# EAGLE design WT12-Teensy3.1 (EAGLE 6.3)
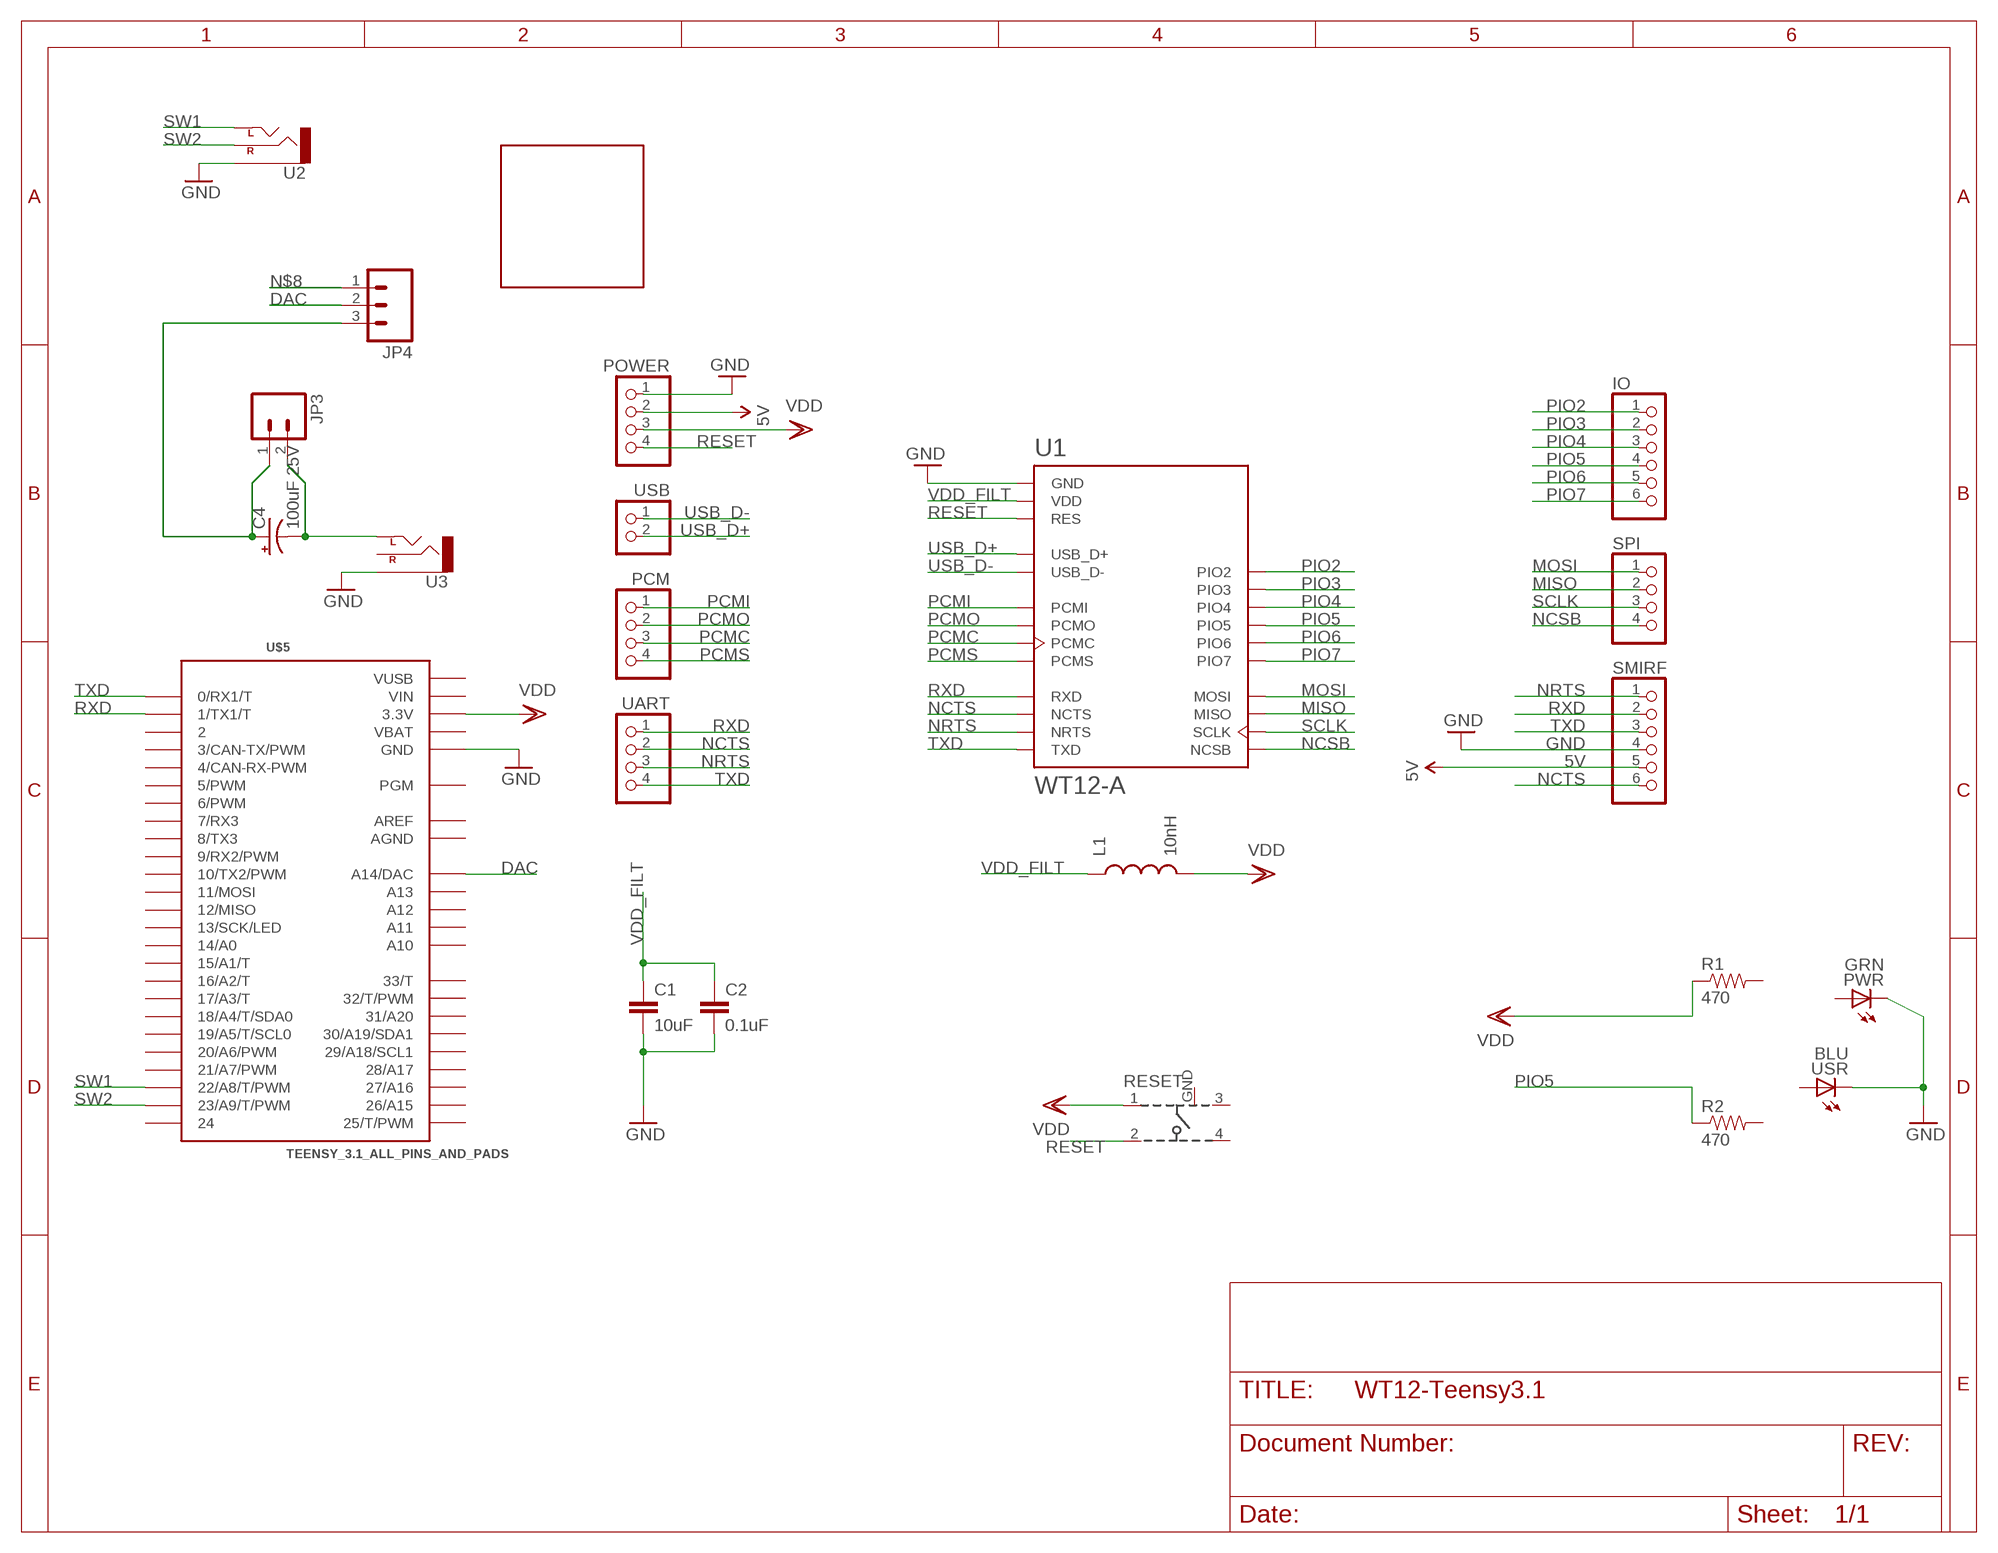
[diagram p0: schematic, sheet 1]

## Parts
C1  10uF  CAP0603-CAP  [0603-CAP]
C2  0.1uF  CAP0603-CAP  [0603-CAP]
C4  100uF 25V  CAP_POLPTH2  [CPOL-RADIAL-10UF-25V]
IO  PINHD-1X6  [1X06]
JP3  M02PTH  [1X02]
JP4  M03LOCK  [1X03_LOCK]
L1  10nH  INDUCTOR0603  [0603]
PCM  PINHD-1X4  [1X04]
POWER  PINHD-1X4  [1X04]
PWR  GRN  LEDCHIPLED_0805  [CHIPLED_0805]
R1  470  RESISTOR0603-RES  [0603-RES]
R2  470  RESISTOR0603-RES  [0603-RES]
RESET  101-IG  [101-IG]
SMIRF  PINHD-1X6  [1X06]
SPI  PINHD-1X4  [1X04]
U1  WT12-A  [WT12-A]
U2  AUDIO-JACKPTH  [AUDIO-JACK]
U3  AUDIO-JACKPTH  [AUDIO-JACK]
U$1  PROTOAREA  [PROTOAREA]
U$5  TEENSY_3.1_ALL_PINS_AND_PADS  [TEENSY_3.1_ALLPINS]
UART  PINHD-1X4  [1X04]
USB  PINHD-1X2  [1X02]
USR  BLU  LEDCHIPLED_0805  [CHIPLED_0805]

## Nets
5V [power]: POWER.2 SMIRF.5
DAC: JP4.2 U$5.A14(A14/DAC)
GND [power]: C1.2 C2.2 POWER.1 PWR.C SMIRF.4 U1.GND U1.GND@2(GND) U1.GND@3(GND) U1.GND@4(GND) U2.SLEEVE U3.SLEEVE USR.C
MISO: SPI.2 U1.MISO
MOSI: SPI.1 U1.MOSI
N$4: R2.1
N$7: C4.2(-) JP3.2 U3.TIP(LEFT)
N$8: JP4.1
N$10: C4.1(+) JP3.1 JP4.3
NCSB: SPI.4 U1.NCSB
NCTS: SMIRF.6 U1.NCTS UART.2
NRTS: SMIRF.1 U1.NRTS UART.3
PCMC: PCM.3 U1.PCMC
PCMI: PCM.1 U1.PCMI
PCMO: PCM.2 U1.PCMO
PCMS: PCM.4 U1.PCMS
PIO2: IO.1 U1.PIO2
PIO3: IO.2 U1.PIO3
PIO4: IO.3 U1.PIO4
PIO5: IO.4 U1.PIO5
PIO6: IO.5 U1.PIO6
PIO7: IO.6 U1.PIO7
RESET: POWER.4 RESET.2 U1.RES
RXD: SMIRF.2 U1.RXD U$5.1(1/TX1/T) UART.1
SCLK: SPI.3 U1.SCLK
SW1: U2.TIP(LEFT) U$5.22/A8(22/A8/T/PWM)
SW2: U2.RING(RIGHT) U$5.23/A9(23/A9/T/PWM)
TXD: SMIRF.3 U1.TXD U$5.0(0/RX1/T) UART.4
USB_D+: U1.USB_D+ USB.2
USB_D-: U1.USB_D- USB.1
VDD [power]: L1.2 POWER.3 RESET.1
VDD_FILT [power]: C1.1 C2.1 L1.1 U1.VDD U1.VDD@2(VDD)
VDDJP1 [power]: R1.1
Unconnected: PWR.A R1.2 R2.2 RESET.3 RESET.4 U3.RING(RIGHT) U$5.2 U$5.3(3/CAN-TX/PWM) U$5.4(4/CAN-RX-PWM) U$5.5(5/PWM) U$5.6(6/PWM) U$5.7(7/RX3) U$5.8(8/TX3) U$5.9(9/RX2/PWM) U$5.10(10/TX2/PWM) U$5.11(11/MOSI) U$5.12(12/MISO) U$5.13(13/SCK/LED) U$5.14/A0 U$5.15/A1(15/A1/T) U$5.16/A2(16/A2/T) U$5.17/A3(17/A3/T) U$5.18/A4(18/A4/T/SDA0) U$5.19/A5(19/A5/T/SCL0) U$5.20/A6(20/A6/PWM) U$5.21/A7(21/A7/PWM) U$5.24 U$5.25(25/T/PWM) U$5.26(26/A15) U$5.27(27/A16) U$5.28(28/A17) U$5.29(29/A18/SCL1) U$5.30(30/A19/SDA1) U$5.31(31/A20) U$5.32(32/T/PWM) U$5.33(33/T) U$5.A10 U$5.A11 U$5.A12 U$5.A13 U$5.PGM USR.A

## Power pins joined to a net without a drawn wire
3.3V: U$5.3.3V U$5.3.3V1(3.3V) U$5.3.3V2(3.3V)
AGND: U$5.AGND
AREF: U$5.AREF
GND: RESET.GND U$5.GND U$5.GND1(GND) U$5.GND2(GND)
VBAT: U$5.VBAT
VIN: U$5.VIN
VUSB: U$5.VUSB

## Library data of the parts
C1 C2 = SparkFun:CAP: Capacitor Standard 0603 ceramic capacitor, and 0.1" leaded capacitor.
C4 = SparkFun-Passives:CAP_POL: Capacitor Polarized These are standard SMD and PTH capacitors. Normally 10uF, 47uF, and 100uF in electrolytic and tantalum varieties. Always verify the external diameter of the through hole cap, it varies with capacity, voltage, and manufacturer. The EIA devices should be standard.
IO SMIRF = sf-pinhead:PINHD-1X6: PIN HEADER
JP3 = SparkFun-Connectors:M02: Header 2 Standard 2-pin 0.1" header. Use with straight break away headers (SKU : PRT-00116), right angle break away headers (PRT-00553), swiss pins (PRT-00743), machine pins (PRT-00117), and female headers (PRT-00115). Molex polarized connector foot print use with SKU : PRT-08233 with associated crimp pins and housings.
JP4 = SparkFun-Connectors:M03: Header 3 Standard 3-pin 0.1" header. Use with straight break away headers (SKU : PRT-00116), right angle break away headers (PRT-00553), swiss pins (PRT-00743), machine pins (PRT-00117), and female headers (PRT-00115). Molex polarized connector foot print use with SKU : PRT-08232 with associated crimp pins and housings.
L1 = SparkFun:INDUCTOR: Inductors Basic Inductor/Choke - 0603 and 1206. Footprints are not proven and vary greatly between part numbers.
PCM POWER SPI UART = sf-pinhead:PINHD-1X4: PIN HEADER
PWR USR = adafruit:LED: LED OSRAM: - CHIPLED LG R971, LG N971, LY N971, LG Q971, LY Q971, LO R971, LY R971 LH N974, LH R974 LS Q976, LO Q976, LY Q976 LO Q996 - Hyper CHIPLED LW Q18S LB Q993, LB Q99A, LB R99A - SideLED LS A670, LO A670, LY A670, LG A670, LP A670 LB A673, LV A673, LT A673, LW A673 LH A674 LY A675 LS A676, LA A676, LO A676, LY A676, LW A676 LS A679, LY A679, LG A679 - Hyper Micro SIDELED® LS Y876, LA Y876, LO Y876, LY Y876 LT Y87S - SmartLED LW L88C, LW L88S LB L89C, LB L89S, LG L890 LS L89K, LO L89K, LY L89K LS L896, LA L896, LO L896, LY L896 - TOPLED LS T670, LO T670, LY T670, LG T670, LP T670 LSG T670, LSP T670, LSY T670, LOP T670, LYG T670 LG T671, LOG T671, LSG T671 LB T673, LV T673, LT T673, LW T673 LH T674 LS T676, LA T676, LO T676, LY T676, LB T676, LH T676, LSB T676, LW T676 LB T67C, LV T67C, LT T67C, LS T67K, LO T67K, LY T67K, LW E67C LS E67B, LA E67B, LO E67B, LY E67B, LB E67C, LV E67C, LT E67C LW T67C LS T679, LY T679, LG T679 LS T770, LO T770, LY T770, LG T770, LP T770 LB T773, LV T773, LT T773, LW T773 LH T774 LS E675, LA E675, LY E675, LS T675 LS T776, LA T776, LO T776, LY T776, LB T776 LHGB T686 LT T68C, LB T68C - Hyper Mini TOPLED® LB M676 - Mini TOPLED Santana® LG M470 LS M47K, LO M47K, LY M47K Source: http://www.osram.convergy.de/
R1 R2 = SparkFun:RESISTOR: Resistor Basic schematic elements and footprints for 0603, 1206, and PTH resistors.
RESET = sf-keyglove:101-IG
U1 = sf-bluegiga:WT12: Bluegiga WT12 class 2 Bluetooth 2.1 + EDR module. WT12-A variant has an on-module ceramic chip antenna. WT12-A variant includes keepout/restrict area. Antenna edge of the module should be flush up against the edge of the PCB. See datasheet for variant layout details. The WT12 is a fully integrated Bluetooth 2.1 + EDR, class 2 module combining antenna, Bluetooth radio, and an on-board iWRAP Bluetooth stack. Bluegiga's WT12 constitutes the ideal solution for developers that want to quickly integrate Bluetooth wireless technology into their design without investing several months in Bluetooth radio and stack development. It uses Bluegiga's iWRAP Bluetooth stack, which is an embedded Bluetooth stack implementing 13 different Bluetooth profiles and Apple iAP connectivity. The WT12 combined with iWRAP Bluetooth stack and Bluegiga's excellent technical support designers ensure quick time-to-market and low development costs and risks. http://www.bluegiga.com/en-US/products/bluetooth-classic-modules/wt12-bluetooth--class-2-module https://github.com/jrowberg/sf-oshw Last updated 2014-01-04 by Jeff Rowberg <jeff@rowberg.net>; ANTENNA: On-module ceramic chip antenna
U2 U3 = SparkFun-Connectors:AUDIO-JACK: 3.5mm Audio Jack Simple 3.5mm common PCB mount audio jack. SKU: PRT-08032
U$1 = zunkworks:PROTOAREA
U$5 = Teensy_3_Series_Board_v1.0:TEENSY_3.1_ALL_PINS_AND_PADS: Footprint for Teensy 3.1 board using all pads and all through-holes. Pads need a 2x7 0.1" SMD header.
USB = sf-pinhead:PINHD-1X2: PIN HEADER

## Net classes
0 default: width 0.152 mm, drill 0.33 mm, clearance 0.152 mm
1 power: width 0.254 mm, drill 0.33 mm, clearance 0.152 mm

## Board
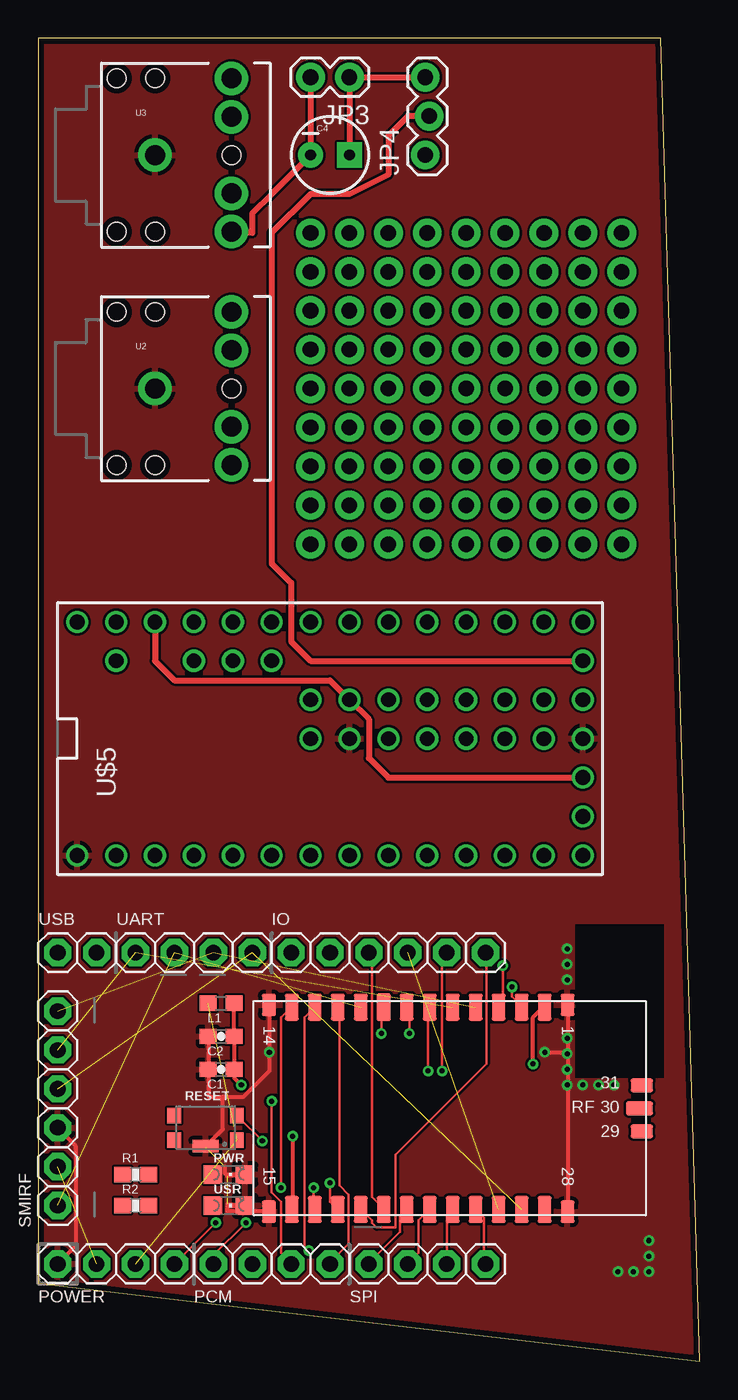
[diagram p1: board, top side]
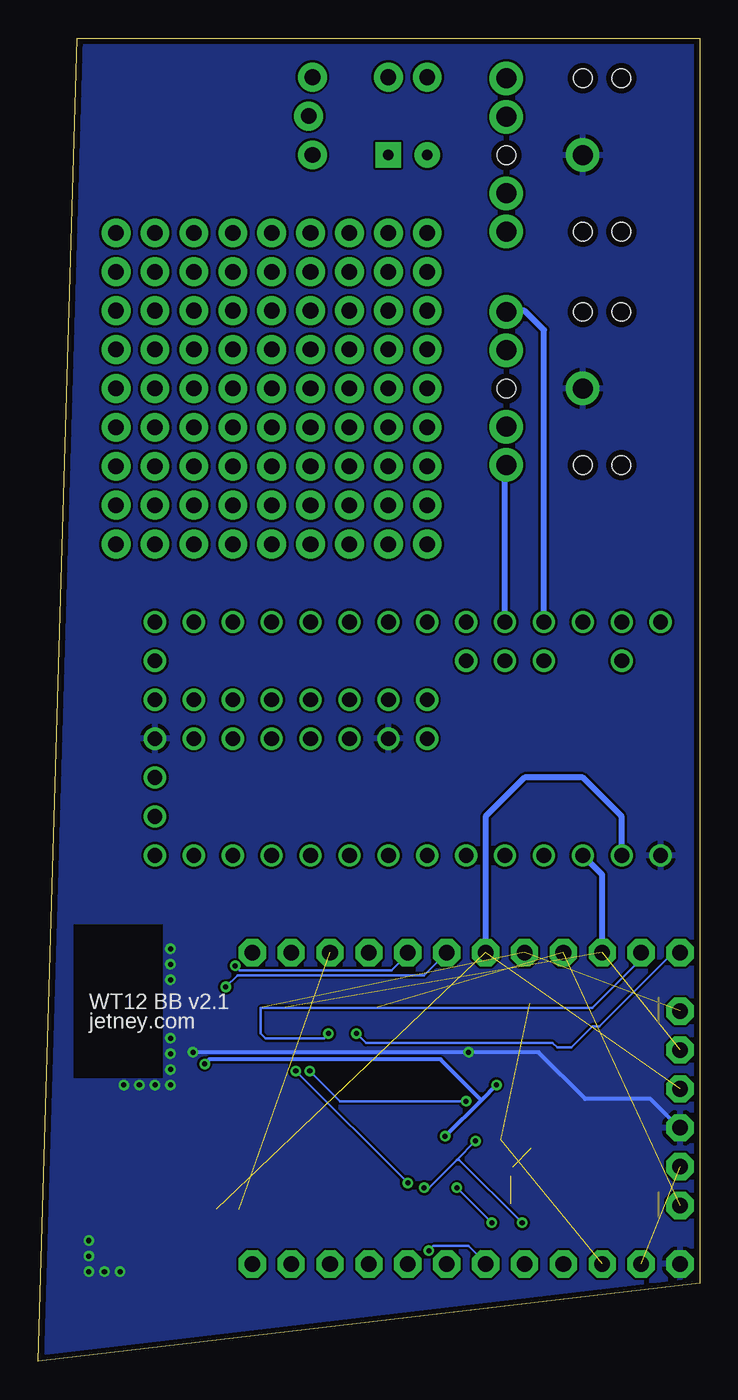
[diagram p2: board, bottom side, seen from below]

Size 43.18 x 86.36 mm. Coordinates in mm from the lower left corner, seen from the top.
Outline: 0,5.08 43.18,0 40.64,86.36 0,86.36 0,5.08
Copper layers (1*16): Top 0.0356mm / dielectric 1.5011mm / Bottom 0.0356mm
Design rules "LaenPCBOrder": minimum track width 6mil, minimum drill 13mil, track to track 6mil, track to pad 6mil, pad to pad 6mil, via to via 6mil, smd to smd 6mil, copper to edge 15mil, drill to drill 6mil, minimum pad ring 7mil, minimum via ring 7mil, stop-mask expansion 3mil, vias tented up to drill 0mil, thermal gap 10mil
vRestrict: area 0,24.4 to 30.5,25.4; area 0,7.6 to 30.5,8.6; area 2.5,8.9 to 3.8,24.1; area 10.2,10.9 to 11.7,11.4; area 10.2,13 to 11.7,13.5

### Footprints (pad centres in the part's own frame; a part is rotated, then mirrored left to right if it is on the bottom)
0603-CAP = smd 1.1 x 1: 1 -0.85,0; 2 0.85,0
CPOL-RADIAL-10UF-25V = drill 0.7 pad 1.651 square: 1 1.27,0 | drill 0.7 pad 1.651: 2 -1.27,0
1X06 = drill 1.016 pad 1.778 octagon: 1 -6.35,0; 2 -3.81,0; 3 -1.27,0; 4 1.27,0; 5 3.81,0; 6 6.35,0
1X02 = drill 1.016 pad 1.88: 1 0,0; 2 2.54,0
1X03_LOCK = drill 1.016 pad 1.88: 1 0,0.127; 2 2.54,-0.127; 3 5.08,0.127
0603 = smd 1.1 x 1: 1 -0.85,0; 2 0.85,0
1X04 = drill 1.016 pad 1.778 octagon: 1 -3.81,0; 2 -1.27,0; 3 1.27,0; 4 3.81,0
CHIPLED_0805 = smd 1.2 x 1.2: A 0,-1.05; C 0,1.05
0603-RES = smd 1.1 x 1: 1 -0.85,0; 2 0.85,0
101-IG = smd 0.9 x 1: 1 -2.05,0.8; 2 -2.05,-0.8; 3 2.05,0.8; 4 2.05,-0.8 | smd 1.7 x 0.8: GND 0,1.2
WT12-A = smd 1.478 x 0.914: GND -6.75,7.7; GND@2 -6.75,-11.8; GND@3 6.75,-11.8; GND@4 6.75,7.7 | smd 1.778 x 0.914: MISO 6.6,0.2; MOSI 6.6,1.7; NC 6.6,6.2; NCSB 6.6,-2.8; NCTS -6.6,-5.8; NRTS -6.6,1.7; PCMC -6.6,-8.8; PCMI -6.6,-7.3; PCMO -6.6,-1.3; PCMS -6.6,-10.3; PIO2 -6.6,4.7; PIO3 -6.6,3.2; PIO4 6.6,-4.3; PIO5 6.6,3.2; PIO6 6.6,-7.3; PIO7 6.6,-5.8; RES 6.6,-8.8; RXD -6.6,0.2; SCLK 6.6,-1.3; TXD 6.6,4.7; USB_D+ -6.6,-2.8; USB_D- -6.6,-4.3; VDD -6.6,6.2; VDD@2 6.6,-10.3 | smd 0.914 x 1.778: RF 0,12.4 | smd 0.914 x 1.478: RFGND 1.5,12.55; RFGND@2 -1.5,12.55
AUDIO-JACK = drill 1.3 pad 2.184: RING 5,5; RSH 5,2.5; SLEEVE 0,0; TIP 5,-5; TSH 5,-2.5 | hole 1.2: 0,5; -2.5,5; -2.5,-5; 0,-5; 5,0
PROTOAREA = drill 1.016 pad 1.88: P$1 2.54,2.54; P$2 0,2.54; P$3 -2.54,2.54; P$4 -5.08,2.54; P$5 5.08,2.54; P$6 5.08,0; P$7 2.54,0; P$8 0,0; P$9 -2.54,0; P$10 -5.08,0; P$11 -5.08,-2.54; P$12 -2.54,-2.54; P$13 0,-2.54; P$14 2.54,-2.54; P$15 5.08,-2.54; P$16 5.08,-5.08; P$17 2.54,-5.08; P$18 0,-5.08; P$19 -2.54,-5.08; P$20 -5.08,-5.08; P$21 -5.08,5.08; P$22 -2.54,5.08; P$23 0,5.08; P$24 2.54,5.08; P$25 5.08,5.08; P$26 7.62,7.62; P$27 7.62,5.08; P$28 7.62,2.54; P$29 7.62,0; P$30 7.62,-2.54; P$31 7.62,-5.08; P$32 7.62,-7.62; P$33 5.08,-7.62; P$34 2.54,-7.62; P$35 0,-7.62; P$36 -2.54,-7.62; P$37 -5.08,-7.62; P$38 -7.62,-7.62; P$39 -7.62,-5.08; P$40 -7.62,-2.54; P$41 -7.62,0; P$42 -7.62,2.54; P$43 -7.62,5.08; P$44 -7.62,7.62; P$45 -5.08,7.62; P$46 -2.54,7.62; P$47 0,7.62; P$48 2.54,7.62; P$49 5.08,7.62; P$50 10.16,10.16; P$51 10.16,7.62; P$52 10.16,5.08; P$53 10.16,2.54; P$54 10.16,0; P$55 10.16,-2.54; P$56 10.16,-5.08; P$57 10.16,-7.62; P$58 10.16,-10.16; P$59 7.62,-10.16; P$60 5.08,-10.16; P$61 2.54,-10.16; P$62 0,-10.16; P$63 -2.54,-10.16; P$64 -5.08,-10.16; P$65 -7.62,-10.16; P$66 -10.16,-10.16; P$67 -10.16,-7.62; P$68 -10.16,-5.08; P$69 -10.16,-2.54; P$70 -10.16,0; P$71 -10.16,2.54; P$72 -10.16,5.08; P$73 -10.16,7.62; P$74 -10.16,10.16; P$75 -7.62,10.16; P$76 -5.08,10.16; P$77 -2.54,10.16; P$78 0,10.16; P$79 2.54,10.16; P$80 5.08,10.16; P$81 7.62,10.16
TEENSY_3.1_ALLPINS = drill 0.965: 0 -7.62,15.24; 1 -7.62,12.7; 2 -7.62,10.16; 3 -7.62,7.62; 3.3V 7.62,12.7; 3.3V1 -2.54,-15.24; 3.3V2 2.54,0; 4 -7.62,5.08; 5 -7.62,2.54; 6 -7.62,0; 7 -7.62,-2.54; 8 -7.62,-5.08; 9 -7.62,-7.62; 10 -7.62,-10.16; 11 -7.62,-12.7; 12 -7.62,-15.24; 13 7.62,-15.24; 14/A0 7.62,-12.7; 15/A1 7.62,-10.16; 16/A2 7.62,-7.62; 17/A3 7.62,-5.08; 18/A4 7.62,-2.54; 19/A5 7.62,0; 20/A6 7.62,2.54; 21/A7 7.62,5.08; 22/A8 7.62,7.62; 23/A9 7.62,10.16; 24 0,-2.54; 25 0,-5.08; 26 0,-7.62; 27 0,-10.16; 28 0,-12.7; 29 2.54,-12.7; 30 2.54,-10.16; 31 2.54,-7.62; 32 2.54,-5.08; 33 2.54,-2.54; A10 5.08,7.62; A11 5.08,5.08; A12 0,2.54; A13 2.54,2.54; A14 5.08,-15.24; AGND 7.62,15.24; AREF 5.08,10.16; GND -7.62,17.78; GND1 0,-15.24; GND2 0,0; PGM 2.54,-15.24; VBAT -5.08,-15.24; VIN 7.62,17.78; VUSB 5.08,15.24
1X02' = drill 1.016 pad 1.778 octagon: 1 -1.27,0; 2 1.27,0

### Placement (x,y rotation side)
C1  11.94,19.05 180 top
C2  11.94,21.21 180 top
C4  19.05,78.74 0 top
IO  22.86,26.67 0 top
JP3  20.32,83.82 180 top
JP4  25.4,78.74 90 top
L1  11.94,23.37 180 top
PCM  15.24,6.35 180 top
POWER  5.08,6.35 0 top
PWR  12.45,12.19 270 top
R1  6.35,12.19 0 top
R2  6.35,10.16 0 top
RESET  10.92,15.24 180 top
SMIRF  1.27,16.51 270 top
SPI  25.4,6.35 180 top
U1  26.86,16.51 270 top
U2  7.62,63.5 0 top
U3  7.62,78.74 0 top
U$1  27.94,63.5 0 top
U$5  20.32,40.64 90 top
UART  10.16,26.67 0 top
USB  [1X02']  2.54,26.67 0 top
USR  12.45,10.16 270 top

### Tracks (layer width: path | path; a pad name or v marks a point on that pad's centre or on a via)
3.3V
  Top 0.406: U$5.3.3V 7.62,45.72 8.89,44.45 19.05,44.45 U$5.3.3V2 21.59,41.91 21.59,39.37 22.86,38.1 U$5.3.3V1
5V  (1 unrouted)
DAC
  Top 0.406: JP4.2 24.13,81.28 22.86,80.01 22.86,77.47 20.32,76.2 17.78,76.2 15.24,73.66 15.24,72.39 15.24,52.07 16.51,50.8 16.51,46.99 17.78,45.72 U$5.A14
GND  (via drill 0.33)  (2 unrouted)
  Top 0.254: C2.2 11.12,21.08 11.12,19.1 C1.2 11.12,18.95 11.12,17.27 12.04,17.27 | 15.09,23.22 v15.09,20.17 15.09,18.95 13.41,17.27 12.04,17.27 | 12.34,10.26 USR.C 12.34,10.11 12.34,9.8 14.94,9.8 | 12.34,12.09 PWR.C 12.19,12.24 12.19,12.7 | 10.97,13.92 RESET.GND 10.97,14.07 12.04,15.14 12.04,17.27 | 34.59,23.22 34.59,20.17 | 34.59,20.17 34.59,9.8 | POWER.1 2.44,7.52 2.44,13.92 2.44,14.07 SMIRF.4 | v33.07,20.17 34.59,20.17
  Bottom 0.254: v33.07,20.17 v15.09,20.17 10.52,20.17 7.47,17.12 3.2,17.12 1.37,15.29 SMIRF.4
  other vias: 34.54,18.03 34.54,19.05 34.54,20.07 34.54,21.08 34.54,24.89 34.54,25.91 34.54,26.92 35.56,18.03 36.58,18.03 37.59,18.03 39.88,5.84 38.86,5.84 37.85,5.84 39.88,6.86 39.88,7.87
  pour Top: 0,86.36 40.64,86.36 43.18,0 0,5.08
  pour Bottom: 0,86.36 40.64,86.36 43.18,0 0,5.08
MISO
  Top 0.152: SPI.2 26.67,9.5 26.98,9.8 U1.MISO
MOSI
  Top 0.152: SPI.1 29.11,6.45 29.11,9.35 28.65,9.8 U1.MOSI
N$7
  Top 0.406: JP3.2 C4.2 15.24,76.2 13.97,74.93 13.97,73.66 12.7,73.66 U3.TIP
N$10
  Top 0.406: JP4.3 JP3.1 C4.1
NCSB
  Top 0.152: SPI.4 21.64,6.45 23.62,8.43 23.62,9.5 23.93,9.8 U1.NCSB
NCTS  (2 unrouted)
NRTS  (2 unrouted)
PCMC  (via drill 0.33)
  Top 0.152: v17.68,7.21 17.37,7.52 17.37,22.45 17.98,23.06 U1.PCMC
  Bottom 0.152: v17.68,7.21 17.37,7.52 15.09,7.52 14.02,6.45 PCM.3
PCMI
  Top 0.152: PCM.1 19.05,6.45 20.27,7.67 20.27,10.87 19.66,11.48 19.66,23.06 U1.PCMI
PCMO  (via drill 0.33)
  Top 0.152: v25.45,18.95 25.45,23.06 U1.PCMO | v15.24,16.97 15.24,11.02 15.85,10.41 15.85,7.06 16.46,6.45 PCM.2
  Bottom 0.152: v25.45,18.95 23.47,16.97 v15.24,16.97
PCMS  (via drill 0.33)
  Top 0.152: v15.85,11.33 15.85,22.45 16.46,23.06 U1.PCMS | v13.56,9.04 11.43,6.91 PCM.4
  Bottom 0.152: v13.56,9.04 v15.85,11.33
PIO2  (via drill 0.33)
  Top 0.152: v30.94,24.44 30.94,23.83 31.55,23.22 U1.PIO2
  Bottom 0.152: v30.94,24.44 30.18,25.2 17.98,25.2 IO.1
PIO3  (via drill 0.33)
  Top 0.152: v30.33,25.81 30.33,23.37 30.18,23.22 U1.PIO3
  Bottom 0.152: v30.33,25.81 30.02,25.5 20.12,25.5 19.05,26.57 IO.2
PIO4
  Top 0.152: IO.3 21.64,26.57 21.79,26.42 21.79,10.72 22.55,9.96 U1.PIO4
PIO5  (1 unrouted)
PIO6  (via drill 0.33)
  Top 0.152: v19.05,11.63 19.05,10.41 19.51,9.96 U1.PIO6 | v26.36,18.95 26.36,26.26 26.67,26.57 IO.5
  Bottom 0.152: v26.36,18.95 v19.05,11.63
PIO7
  Top 0.152: IO.6 29.26,26.57 29.26,19.41 23.32,13.46 23.32,8.74 22.1,8.74 21.79,9.04 21.79,9.2 21.18,9.8 U1.PIO7
RESET  (via drill 0.33)
  Top 0.152: v14.63,14.38 13.11,15.9 RESET.2 | v17.98,11.33 17.98,9.96 U1.RES | v11.58,9.04 POWER.4
  Bottom 0.152: 15.85,13.16 17.68,11.33 v17.98,11.33 | 15.85,13.16 v14.63,14.38 | v11.58,9.04 15.7,13.16 15.85,13.16
RXD  (2 unrouted)
  Bottom 0.406: UART.1 6.35,31.75 U$5.1
SCLK
  Top 0.152: SPI.3 24.84,7.06 24.84,9.2 25.45,9.8 U1.SCLK
SW1
  Bottom 0.406: U$5.22/A8 12.7,58.42 U2.TIP
SW2
  Bottom 0.406: U$5.23/A9 10.16,67.31 11.43,68.58 12.54,68.58 U2.RING
TXD  (2 unrouted)
  Bottom 0.406: U$5.0 5.08,35.56 7.62,38.1 11.43,38.1 13.97,35.56 UART.4
USB_D+  (via drill 0.33)
  Top 0.152: v24.23,21.39 24.23,22.91 24.08,23.06 U1.USB_D+
  Bottom 0.152: v24.23,21.39 24.54,21.08 28.35,21.08 28.65,21.39 28.65,23.06 7.01,23.06 3.81,26.26 USB.2
USB_D-  (via drill 0.33)
  Top 0.152: v22.4,21.39 22.4,22.91 22.55,23.06 U1.USB_D-
  Bottom 0.152: v22.4,21.39 21.79,20.78 9.6,20.78 9.3,20.47 8.38,20.47 7.01,21.84 6.55,21.84 1.83,26.57 1.37,26.57 USB.1
VDD  (2 unrouted)
VDD_FILT  (via drill 0.33)
  Top 0.254: L1.1 12.8,23.37 12.8,21.23 C2.1 12.8,21.08 12.8,19.1 C1.1 12.8,18.95 12.8,18.49 v13.26,18.03 | v16.61,14.68 16.61,9.96 U1.VDD@2 | v32.31,19.41 32.31,22.45 32.92,23.06 U1.VDD
  Bottom 0.254: v13.26,18.03 14.25,17.04 | 14.25,17.04 v16.61,14.68 | v32.31,19.41 32,19.71 16.92,19.71 14.25,17.04

### Text on the board
bPlace: WT12 BB v2.1 | jetney.com
tDocu: D- D+ | RTS RXD TXD GND VCC CTS | RXD CTS RTS TXD | P2 P3 P4 P5 P6 P7 | Bluegiga / WT12-A | GND 3V3 RES SYN CLK OUT CSB SCK | 5V | IN | MISO | MOSI
bDocu: RTS RXD TXD GND VCC CTS | PWR | PIO5